# EAGLE design JFET meter (EAGLE 9.6.2)
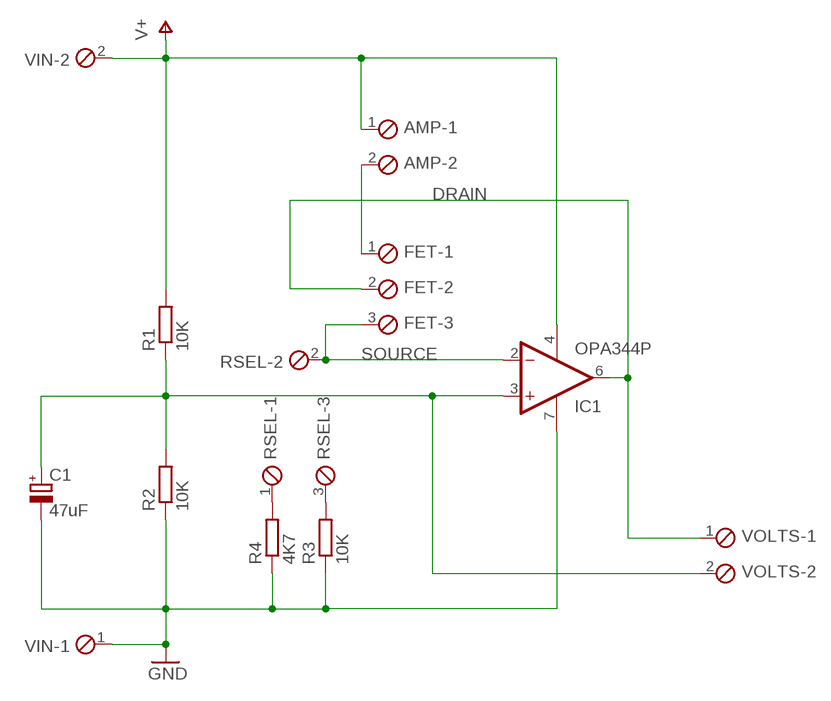
[diagram p0: schematic, sheet 1]

## Parts
AMP  MPT2  [2POL254]
C1  47uF  CPOL-EUE5-10.5  [E5-10,5]
FET  MPT3  [3POL254]
IC1  OPA344P  [DIL08]
R1  10K  R-EU_0207/10  [0207/10]
R2  10K  R-EU_0207/10  [0207/10]
R3  10K  R-EU_0207/10  [0207/10]
R4  4K7  R-EU_0207/10  [0207/10]
RSEL  MPT3  [3POL254]
VIN  MPT2  [2POL254]
VOLTS  MPT2  [2POL254]

## Nets
DRAIN: AMP.2 FET.1
GND: C1.- IC1.7(V+) R2.1 R3.1 R4.1 VIN.1
N$1: C1.+ IC1.3(+IN) R1.1 R2.2 VOLTS.2
N$4: FET.2 IC1.6(OUT) VOLTS.1
N$5: R4.2 RSEL.1
N$6: R3.2 RSEL.3
SOURCE: FET.3 IC1.2(-IN) RSEL.2
V+: AMP.1 IC1.4(V-) R1.2 VIN.2

## Library data of the parts
AMP VIN VOLTS = con-phoenix-254:MPT2: PHOENIX CONNECTOR; OC_FARNELL: unknown; OC_NEWARK: unknown
C1 = rcl:CPOL-EU: POLARIZED CAPACITOR, European symbol; SPICEPREFIX: C
FET RSEL = con-phoenix-254:MPT3: PHOENIX CONNECTOR; OC_FARNELL: unknown; OC_NEWARK: unknown
IC1 = linear:OPA*: Single Operational Amplifier Low Power, Single-Supply, Rail-To-Rail Operational Amplifier Source: http://focus.ti.com/lit/ds/symlink/opa2345.pdf
R1-R4 = rcl:R-EU_: RESISTOR, European symbol; SPICEPREFIX: R

## Board
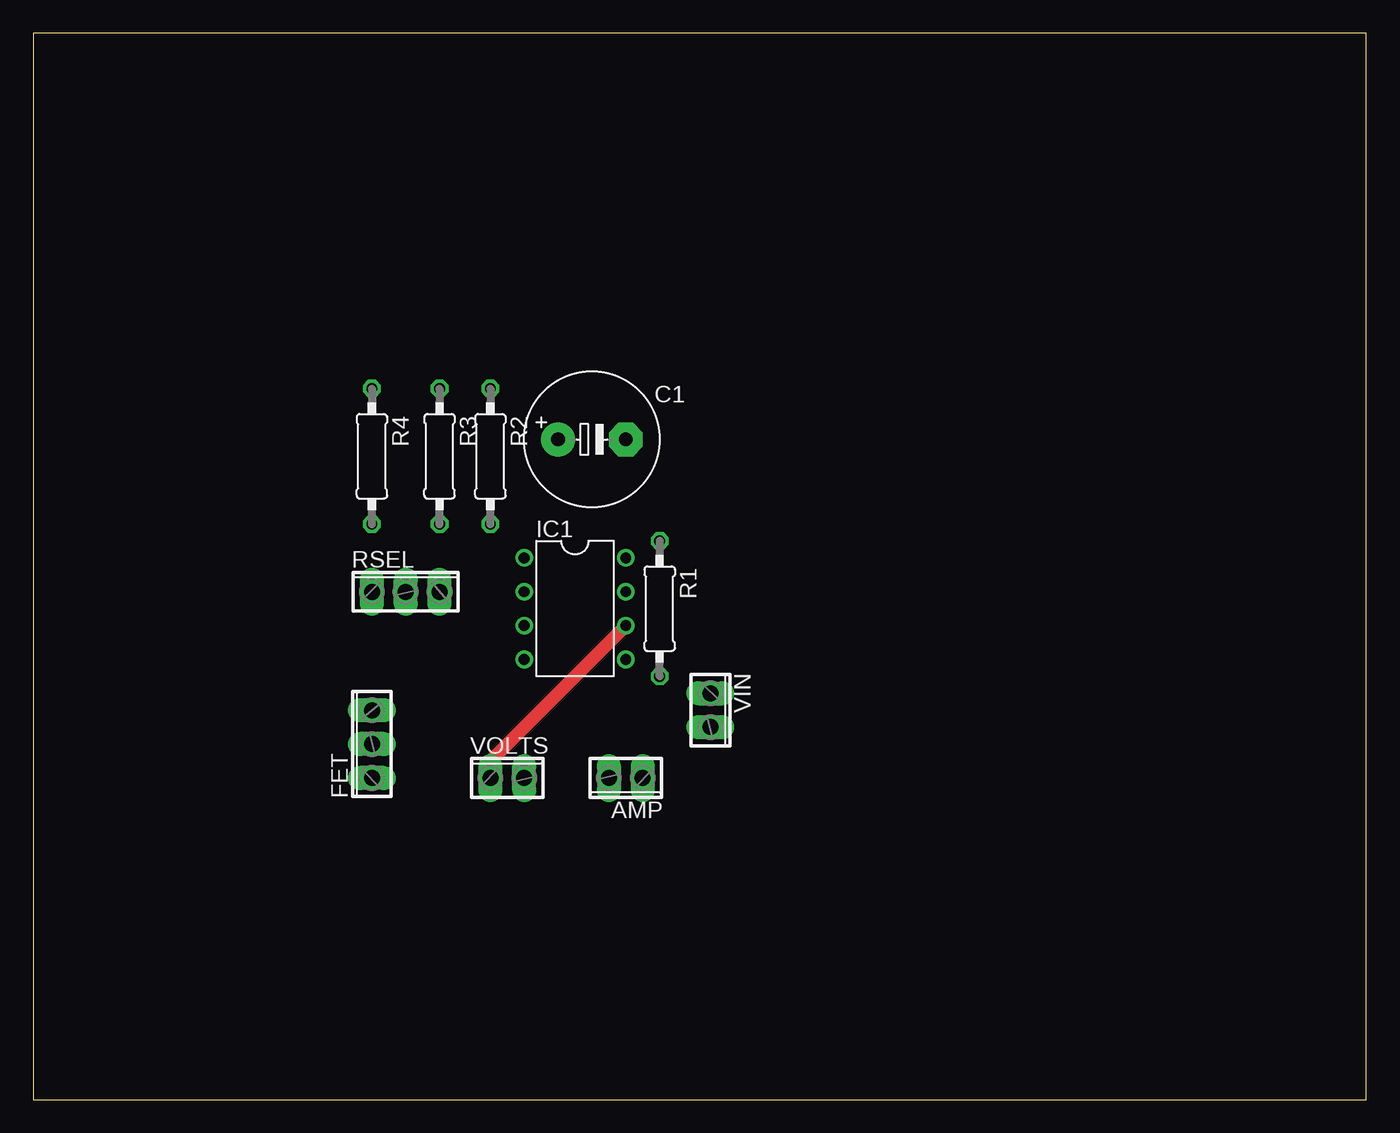
[diagram p1: board, top side]
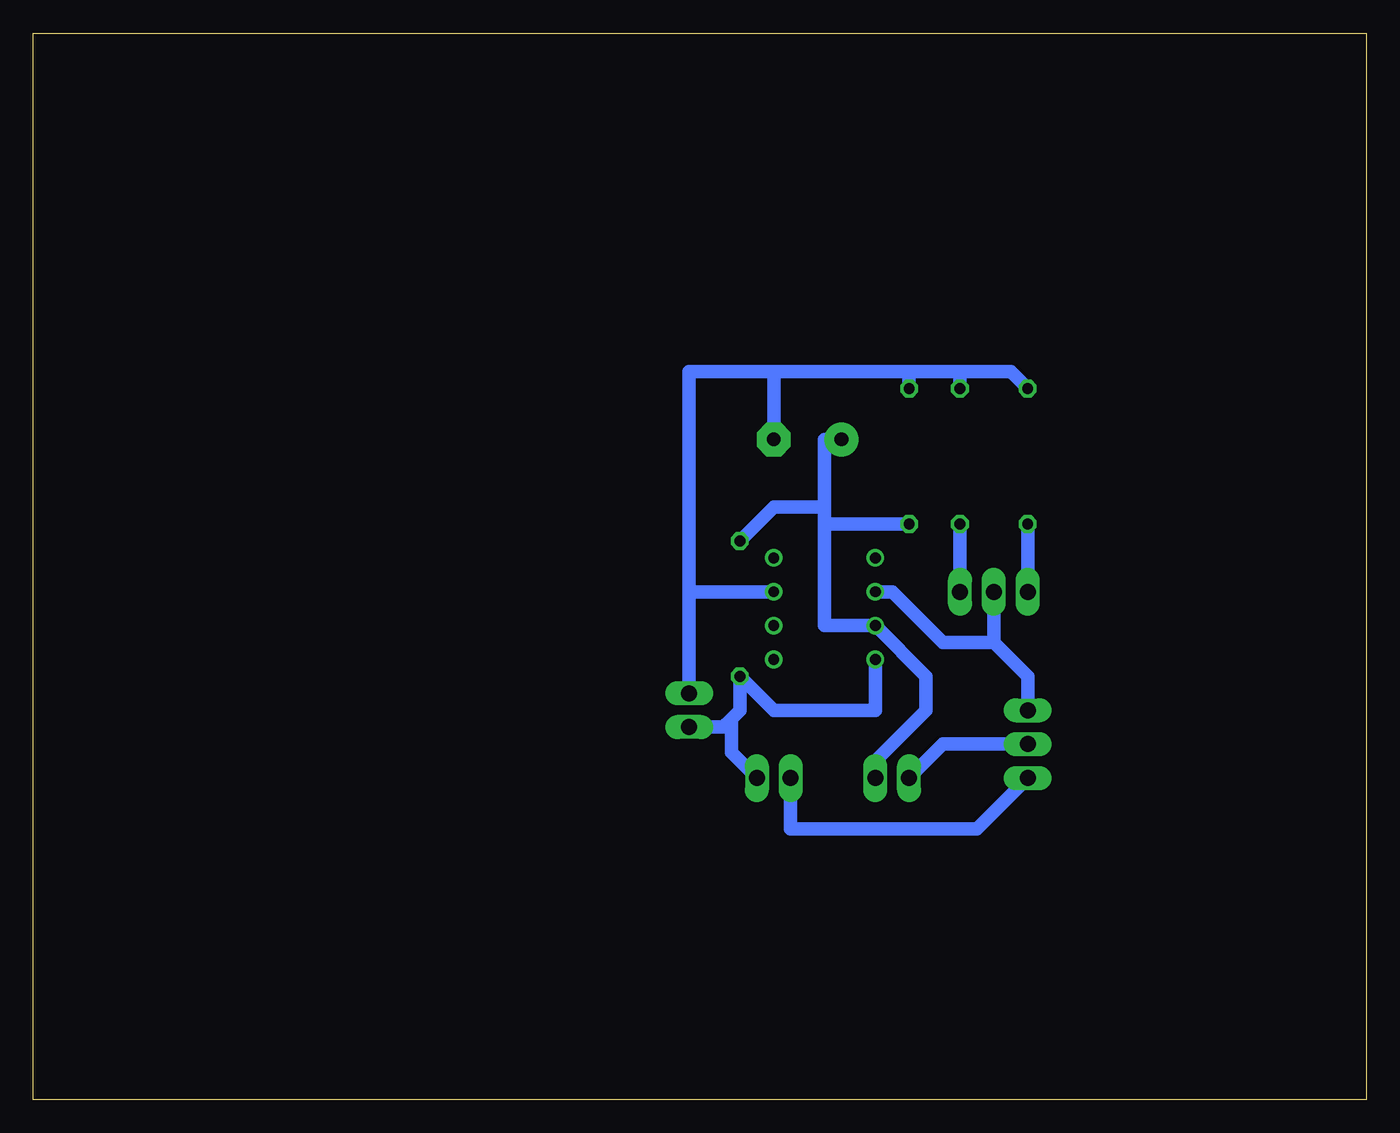
[diagram p2: board, bottom side, seen from below]

Size 100 x 80 mm. Coordinates in mm from the lower left corner, seen from the top.
Outline: 0,0 100,0 100,80 0,80 0,0
Copper layers (1*16): Top 0.035mm / dielectric 1.5mm / Bottom 0.035mm
Design rules "default": minimum track width 6mil, minimum drill 0.35mm, track to track 6mil, track to pad 6mil, pad to pad 6mil, via to via 6mil, smd to smd 6mil, copper to edge 40mil, drill to drill 6mil, minimum pad ring 10mil, minimum via ring 8mil, stop-mask expansion 4mil, vias tented up to drill 0mil, thermal gap 10mil

### Footprints (pad centres in the part's own frame; a part is rotated, then mirrored left to right if it is on the bottom)
2POL254 = drill 1.2 long: 1 -1.27,0; 2 1.27,0
E5-10,5 = drill 1.016 pad 2.54: + -2.54,0 | drill 1.016 pad 2.54 octagon: - 2.54,0
3POL254 = drill 1.2 long: 1 -2.54,0; 2 0,0; 3 2.54,0
DIL08 = drill 0.813 pad 1.27: 1 -3.81,-3.81; 2 -1.27,-3.81; 3 1.27,-3.81; 4 3.81,-3.81; 5 3.81,3.81; 6 1.27,3.81; 7 -1.27,3.81; 8 -3.81,3.81
0207/10 = drill 0.813 octagon: 1 -5.08,0; 2 5.08,0

### Placement (x,y rotation side)
AMP  44.45,24.13 180 top
C1  41.91,49.53 0 top
FET  25.4,26.67 90 top
IC1  40.64,36.83 270 top
R1  46.99,36.83 270 top
R2  34.29,48.26 270 top
R3  30.48,48.26 270 top
R4  25.4,48.26 270 top
RSEL  27.94,38.1 0 top
VIN  50.8,29.21 270 top
VOLTS  35.56,24.13 0 top

### Tracks (layer width: path | path; a pad name or v marks a point on that pad's centre or on a via)
DRAIN
  Bottom 1.016: FET.1 29.21,20.32 43.18,20.32 AMP.2
GND
  Bottom 1.016: VIN.1 50.8,38.1 | 50.8,38.1 50.8,54.61 44.45,54.61 | 44.45,54.61 34.29,54.61 | 34.29,54.61 30.48,54.61 | 30.48,54.61 26.67,54.61 R4.1 | R3.1 30.48,54.61 | R2.1 34.29,54.61 | C1.- 44.45,54.61 | IC1.7 50.8,38.1
N$1
  Bottom 1.016: 40.64,43.18 40.64,35.56 IC1.3 33.02,31.75 33.02,29.21 36.83,25.4 VOLTS.2 | 40.64,43.18 40.64,44.45 | 40.64,44.45 40.64,49.53 C1.+ | R2.2 40.64,43.18 | R1.1 44.45,44.45 40.64,44.45
N$4
  Top 1.016: VOLTS.1 34.29,25.4 IC1.6
  Bottom 1.016: FET.2 31.75,26.67 VOLTS.1
N$5
  Bottom 1.016: R4.2 RSEL.1
N$6
  Bottom 1.016: R3.2 RSEL.3
SOURCE
  Bottom 1.016: RSEL.2 27.94,34.29 | 27.94,34.29 31.75,34.29 35.56,38.1 IC1.2 | FET.3 25.4,31.75 27.94,34.29
V+
  Bottom 1.016: 47.62,28.57 46.99,29.21 R1.2 44.45,29.21 36.83,29.21 IC1.4 | 47.62,28.57 48.26,27.94 VIN.2 | AMP.1 47.62,26.04 47.62,28.57